# Altium schematic sheet QCLogic Rev A Sht6 Connector.SchDoc
size A4
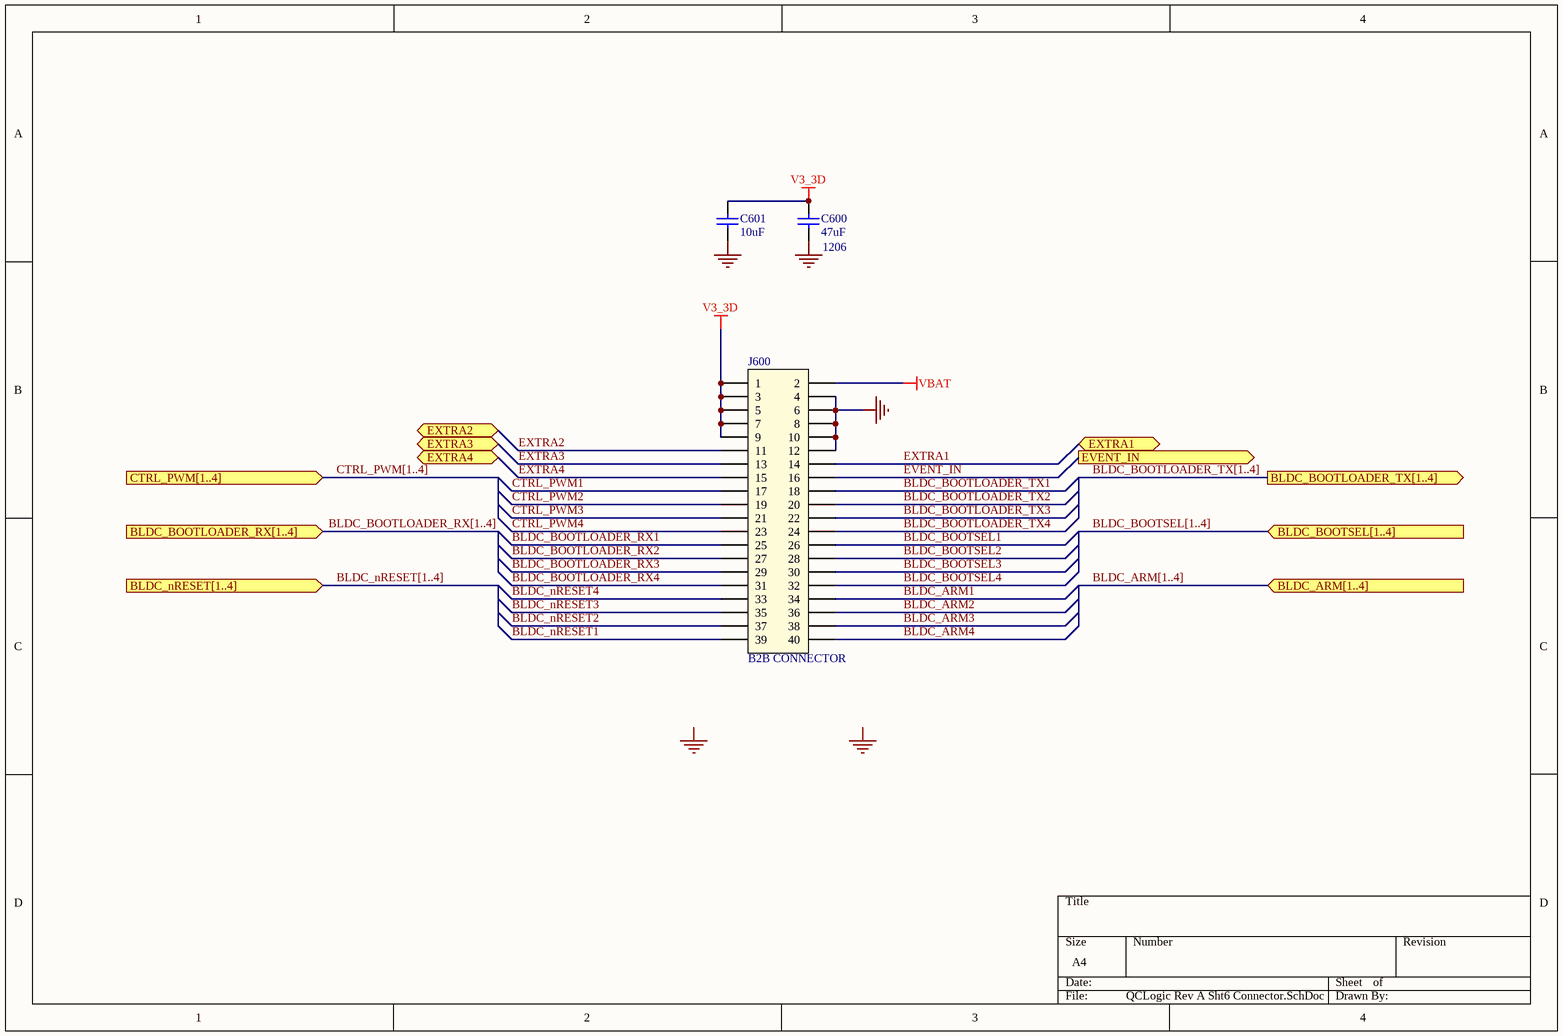
[diagram p0: QCLogic Rev A Sht6 Connector.SchDoc]

## Parts
C600  47uF  4. Package: 1206  [SMD CAP 1206]
C601  10uF  [SMD CAP 0805]
J600  B2B CONNECTOR  [CONN B2B RECPT 40POS SMD GOLD]

## Ports
BLDC_ARM[1..4] (in), BLDC_BOOTLOADER_RX[1..4] (in), BLDC_BOOTLOADER_TX[1..4] (out), BLDC_BOOTSEL[1..4] (in), BLDC_nRESET[1..4] (in), CTRL_PWM[1..4] (in), EVENT_IN (out), EXTRA1 (bidir), EXTRA2 (bidir), EXTRA3 (bidir), EXTRA4 (bidir)

## Nets
GND: C600.2 C601.2 J600.4 J600.6 J600.8 J600.10 J600.12
V3_3D: C600.1 C601.1 J600.1 J600.3 J600.5 J600.7 J600.9
VBAT: J600.2
BLDC_ARM1: J600.34
BLDC_ARM2: J600.36
BLDC_ARM3: J600.38
BLDC_ARM4: J600.40
BLDC_BOOTLOADER_RX1: J600.25
BLDC_BOOTLOADER_RX2: J600.27
BLDC_BOOTLOADER_RX3: J600.29
BLDC_BOOTLOADER_RX4: J600.31
BLDC_BOOTLOADER_TX1: J600.18
BLDC_BOOTLOADER_TX2: J600.20
BLDC_BOOTLOADER_TX3: J600.22
BLDC_BOOTLOADER_TX4: J600.24
BLDC_BOOTSEL1: J600.26
BLDC_BOOTSEL2: J600.28
BLDC_BOOTSEL3: J600.30
BLDC_BOOTSEL4: J600.32
BLDC_nRESET1: J600.39
BLDC_nRESET2: J600.37
BLDC_nRESET3: J600.35
BLDC_nRESET4: J600.33
CTRL_PWM1: J600.17
CTRL_PWM2: J600.19
CTRL_PWM3: J600.21
CTRL_PWM4: J600.23
EVENT_IN: J600.16 ; port EVENT_IN
EXTRA1: J600.14 ; port EXTRA1
EXTRA2: J600.11 ; port EXTRA2
EXTRA3: J600.13 ; port EXTRA3
EXTRA4: J600.15 ; port EXTRA4

## Buses and harness runs
bus BLDC_ARM[1..4] = port BLDC_ARM[1..4]
bus BLDC_BOOTLOADER_RX[1..4] = port BLDC_BOOTLOADER_RX[1..4]
bus BLDC_BOOTLOADER_TX[1..4] = port BLDC_BOOTLOADER_TX[1..4]
bus BLDC_BOOTSEL[1..4] = port BLDC_BOOTSEL[1..4]
bus BLDC_nRESET[1..4] = port BLDC_nRESET[1..4]
bus CTRL_PWM[1..4] = port CTRL_PWM[1..4]

## Notes on the sheet
- Labels drawn without touching a wire or pin: GND

## Library data of the parts
C600 = CAP MLCC SMD: CAP CER 47UF 10V X5R 1206; 1. Manufacturer: Samsung Electro-Mechanics; 2. Manufacturer Part Number: CL31A476MPHNNNE; 3. Date Modified: 20201128
C601 = CAP MLCC SMD: CAP CER 10UF 25V X5R 0805; 1. Manufacturer: Taiyo Yuden; 2. Manufacturer Part Number: TMK212BBJ106KG-T; 4. Package: 0805; 3. Date Modified: 20201128
J600 = CONN B2B RCPT 40POS SMD GOLD: 40 Position Connector Receptacle, Outer Shroud Contacts Surface Mount Gold; 1. Manufacturer: Amphenol ICC (FCI); 2. Manufacturer Part Number: 10144517-041802LF; 3. Date Modified: 20201130